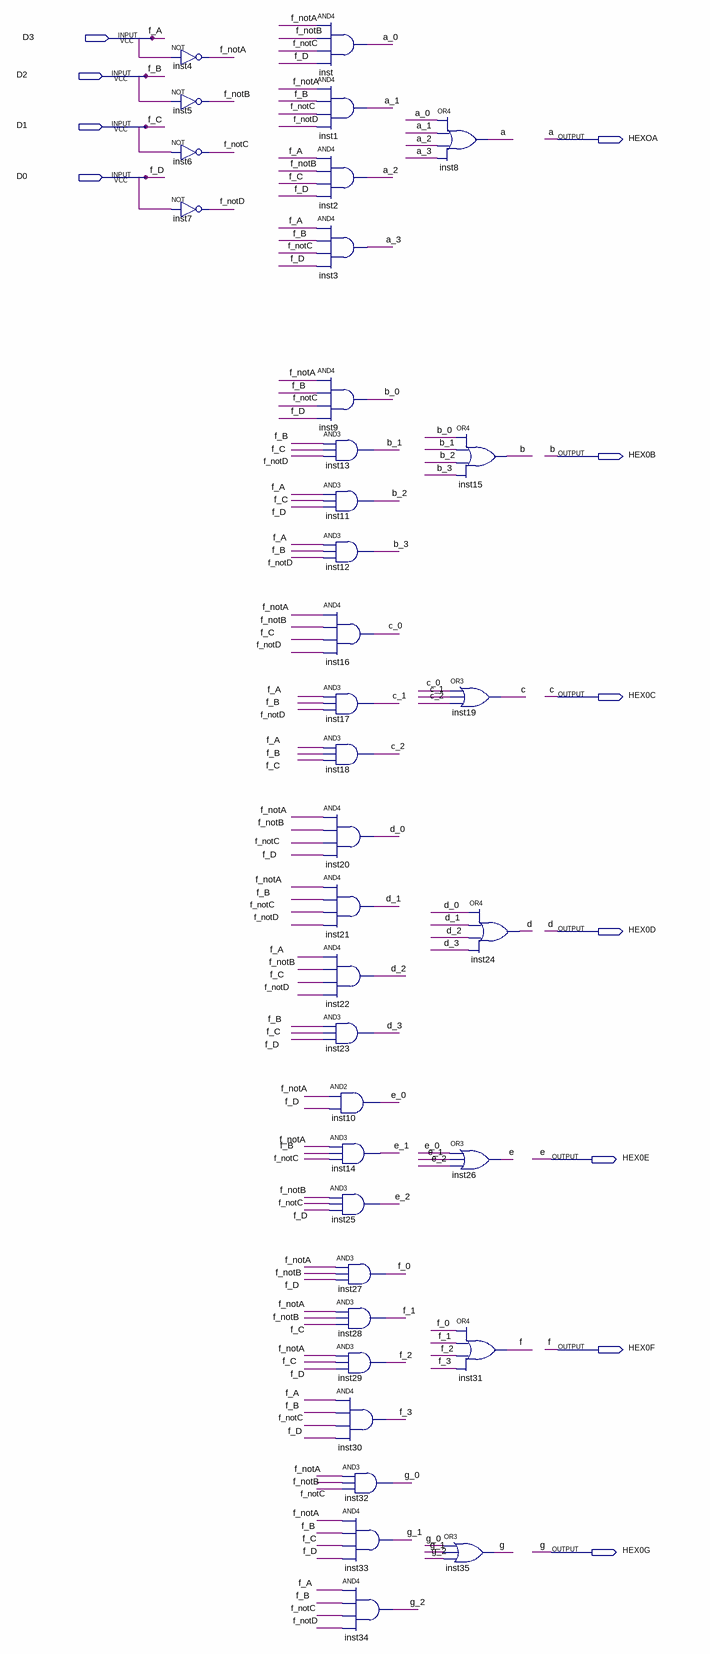
[diagram p0: schematic sheet]
// Quartus schematic display.bdf as structural Verilog: 36 symbols, 11 pins
module display (
  input  D3,
  input  D2,
  input  D1,
  input  D0,
  output HEXOA,
  output HEX0B,
  output HEX0C,
  output HEX0D,
  output HEX0E,
  output HEX0F,
  output HEX0G
);

  wire a_0, a_1, a_2, a_3, b_0, b_1, b_2, b_3, c_0, c_1, c_2, d_0, d_1, d_2, d_3, e_0, e_1, e_2, f_0, f_1,
       f_2, f_3, f_notA, f_notB, f_notC, f_notD, g_0, g_1, g_2;

  not inst4 (f_notA, D3);
  not inst5 (f_notB, D2);
  not inst6 (f_notC, D1);
  not inst7 (f_notD, D0);
  and inst (a_0, f_notA, f_notB, f_notC, D0);
  and inst1 (a_1, f_notA, D2, f_notC, f_notD);
  and inst2 (a_2, D3, f_notB, D1, D0);
  and inst3 (a_3, D3, D2, f_notC, D0);
  and inst9 (b_0, f_notA, D2, f_notC, D0);
  and inst13 (b_1, D2, D1, f_notD);
  and inst11 (b_2, D3, D1, D0);
  and inst12 (b_3, D3, D2, f_notD);
  and inst16 (c_0, f_notA, f_notB, D1, f_notD);
  and inst17 (c_1, D3, D2, f_notD);
  and inst18 (c_2, D3, D2, D1);
  and inst20 (d_0, f_notA, f_notB, f_notC, D0);
  and inst21 (d_1, f_notA, D2, f_notC, f_notD);
  and inst22 (d_2, D3, f_notB, D1, f_notD);
  and inst23 (d_3, D2, D1, D0);
  and inst10 (e_0, f_notA, D0);
  and inst14 (e_1, f_notA, D2, f_notC);
  and inst25 (e_2, f_notB, f_notC, D0);
  and inst27 (f_0, f_notA, f_notB, D0);
  and inst28 (f_1, f_notA, f_notB, D1);
  and inst29 (f_2, f_notA, D1, D0);
  and inst30 (f_3, D3, D2, f_notC, D0);
  and inst32 (g_0, f_notA, f_notB, f_notC);
  and inst33 (g_1, f_notA, D2, D1, D0);
  and inst34 (g_2, D3, D2, f_notC, f_notD);
  or inst8 (HEXOA, a_0, a_1, a_2, a_3);
  or inst35 (HEX0G, g_0, g_1, g_2);
  or inst15 (HEX0B, b_0, b_1, b_2, b_3);
  or inst19 (HEX0C, c_0, c_1, c_2);
  or inst24 (HEX0D, d_0, d_1, d_2, d_3);
  or inst26 (HEX0E, e_0, e_1, e_2);
  or inst31 (HEX0F, f_0, f_1, f_2, f_3);

  // Other names for the same wires on the sheet: a = HEXOA; b = HEX0B; c = HEX0C; d = HEX0D; f_D = D0; f_C = D1;
  //   f_B = D2; f_A = D3; e = HEX0E; f = HEX0F; g = HEX0G
endmodule
